# Altium schematic sheet Customer_Module-APS_Connector.SchDoc
size A4
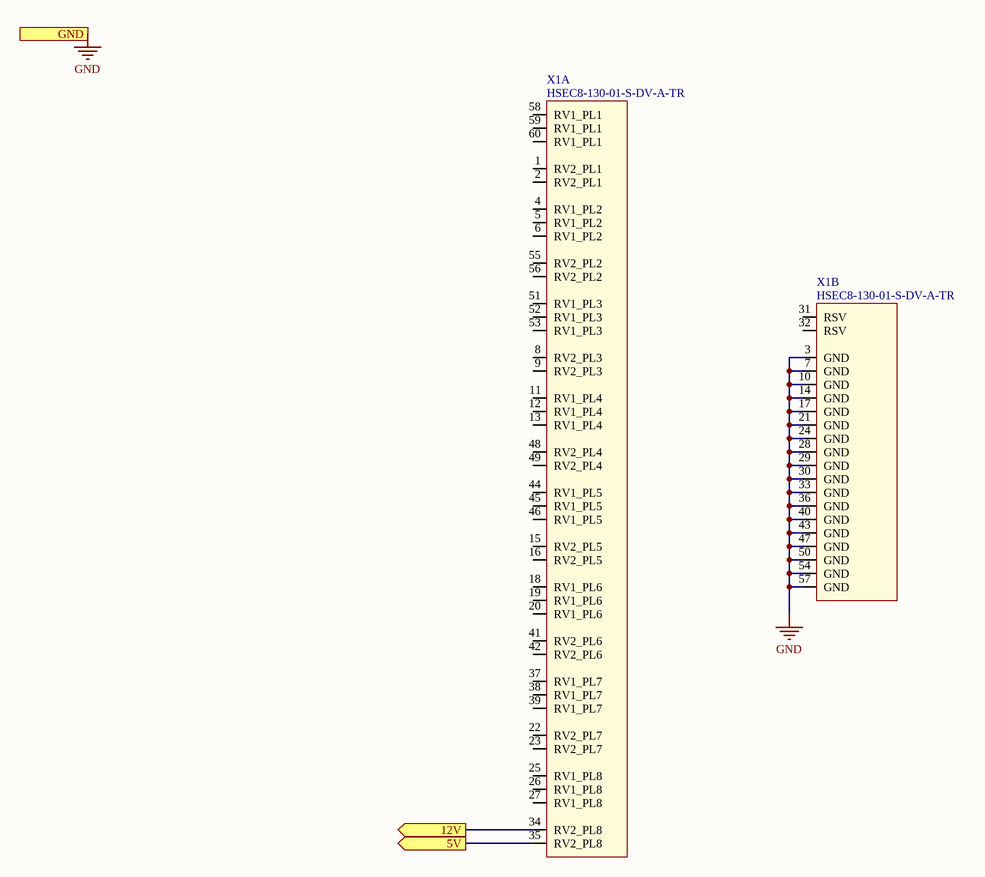
[diagram p0: Customer_Module-APS_Connector.SchDoc]

## Parts
X1  HSEC8-130-01-S-DV-A-TR  [HSEC8-130-01-S-DV-A-TR]  (parts A,B of 2)

## Ports
5V (out), 12V (out), GND

## Nets
GND: X1.3(GND) X1.7(GND) X1.10(GND) X1.14(GND) X1.17(GND) X1.21(GND) X1.24(GND) X1.28(GND) X1.29(GND) X1.30(GND) X1.33(GND) X1.36(GND) X1.40(GND) X1.43(GND) X1.47(GND) X1.50(GND) X1.54(GND) X1.57(GND) ; port GND
5V: X1.35(RV2_PL8) ; port 5V
12V: X1.34(RV2_PL8) ; port 12V

Not connected (* = marked no-connect by the designer): X1 1(RV2_PL1) 2(RV2_PL1) 4(RV1_PL2) 5(RV1_PL2) 6(RV1_PL2) 8(RV2_PL3) 9(RV2_PL3) 11(RV1_PL4) 12(RV1_PL4) 13(RV1_PL4) 15(RV2_PL5) 16(RV2_PL5) 18(RV1_PL6) 19(RV1_PL6) 20(RV1_PL6) 22(RV2_PL7) 23(RV2_PL7) 25(RV1_PL8) 26(RV1_PL8) 27(RV1_PL8) 31(RSV) 32(RSV) 37(RV1_PL7) 38(RV1_PL7) 39(RV1_PL7) 41(RV2_PL6) 42(RV2_PL6) 44(RV1_PL5) 45(RV1_PL5) 46(RV1_PL5) 48(RV2_PL4) 49(RV2_PL4) 51(RV1_PL3) 52(RV1_PL3) 53(RV1_PL3) 55(RV2_PL2) 56(RV2_PL2) 58(RV1_PL1) 59(RV1_PL1) 60(RV1_PL1)